# EasyEDA Pro project ProPrj_Hitboard Zero PCB typec 左上开口_2026-02-22.epro

# Board PCB1
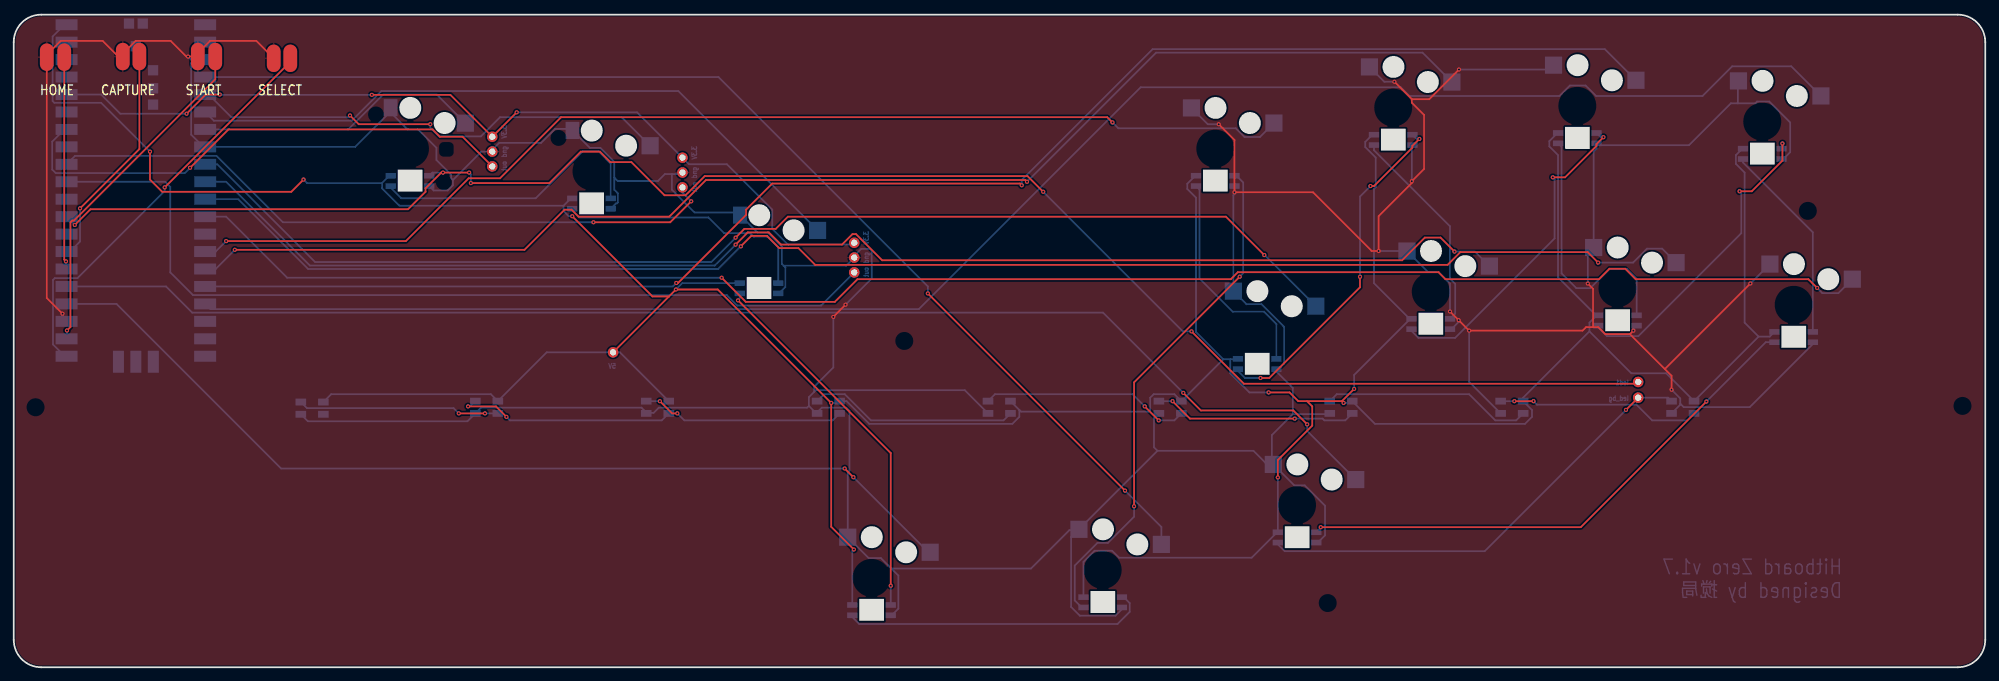
[diagram p0: board, top side]
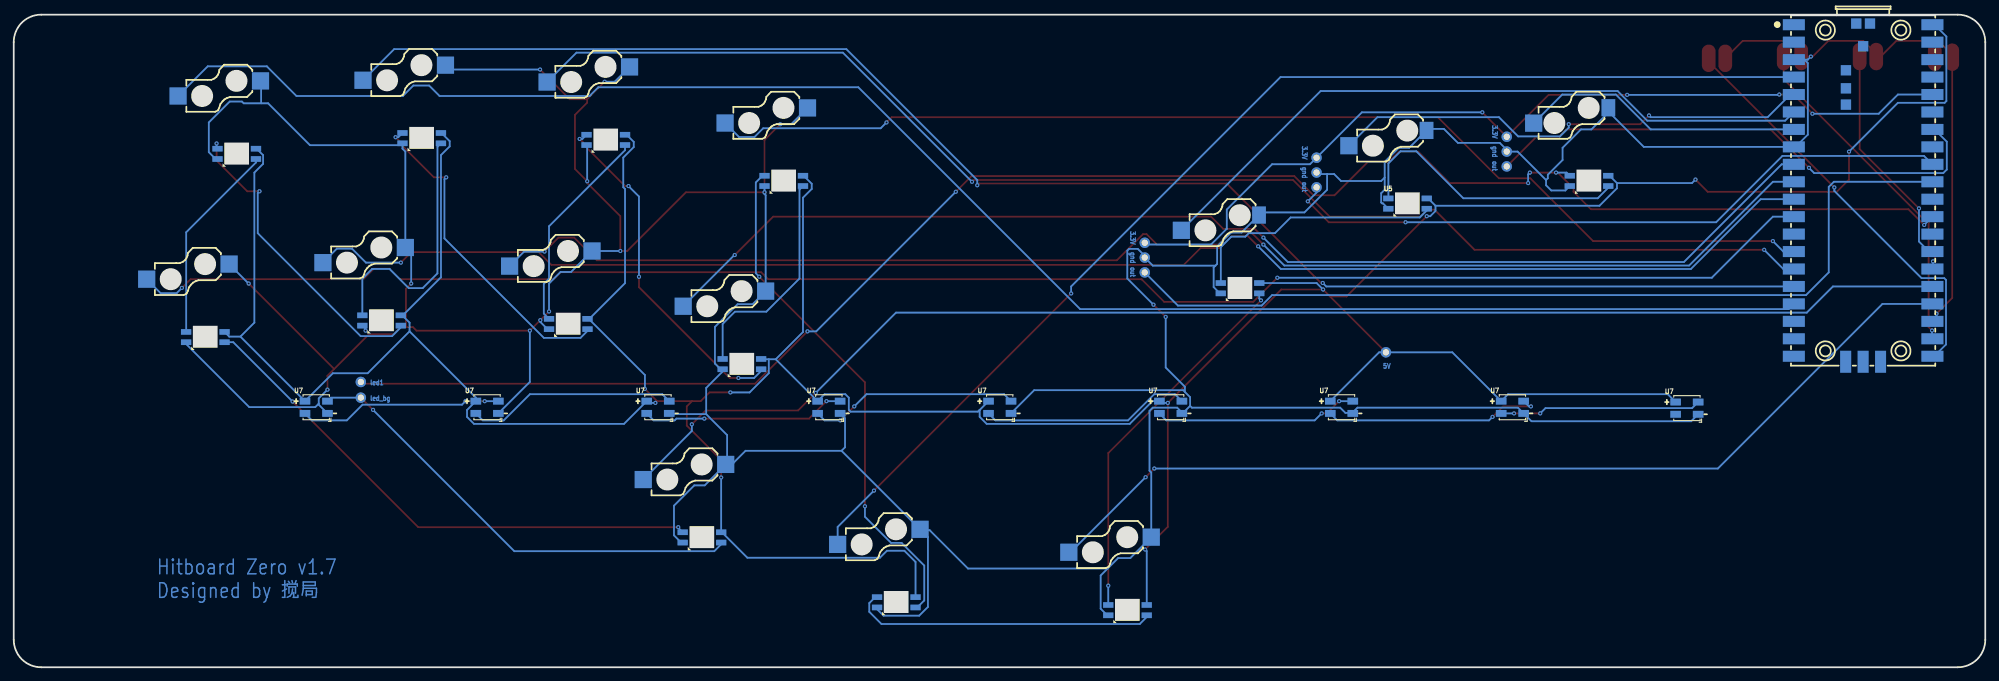
[diagram p1: board, bottom side, seen from below]

Outline 287 x 95 mm; copper layers: Top Layer, Bottom Layer. Coordinates in mm from the lower left corner of the outline.
Outline path: 0,91 arc(1.17,93.83) 4,95 283,95 arc(285.83,93.83) 287,91 287,4 arc(285.83,1.17) 283,0 4,0 arc(1.17,1.17) 0,4 0,91
Stack: Top Layer 0.035mm / Dielectric1 1.51mm FR4 er 4.5 / Bottom Layer 0.035mm

## Design rules (mm)
template: JLCPCB Capability(Two Layers Board)
spacing copperThickness1oz (default): track to track 0.102, other pairs 0.152 to 0.3
spacing copperThickness2oz: track to track 0.203, other pairs 0.152 to 0.3
track width copperThickness1oz (default): min 0.127, default 0.254, max 2.54
track width copperThickness2oz: min 0.203, default 0.254, max 2.54
differential pair differentialPair (default): width min 0.127, default 0.254, max 2.54; gap min 0.152, default 0.152
via viaSize (default): diameter min 0.5, default 0.61, max 10; hole min 0.3, default 0.305, max 6.3

## Placement (name value [footprint] x y rotation side)
NOREF  -  [Pad_e10666]  97.35 69.86 90 top
NOREF#2  -  [Pad_e679]  26.8 88.9 0 top
NOREF#3  -  [Pad_e10656]  122.35 61.8 90 top
NOREF#4  -  [Pad_e682]  40.26 88.65 0 top
NOREF#5  -  [Pad_e10671]  69.66 75.07 90 top
NOREF#6  -  [Pad_e5255]  236.47 39.24 0 top
NOREF#7  -  [Pad_e675]  4.81 88.81 0 top
NOREF#8  -  [Pad_e10670]  69.66 77.23 90 top
NOREF#9  -  [Pad_e681]  37.85 88.65 0 top
NOREF#10  -  [Pad_e10664]  97.35 74.18 90 top
NOREF#11  -  [Pad_e10672]  69.66 72.91 90 top
NOREF#12  -  [Pad_e680]  29.34 88.9 0 top
NOREF#13  -  [Pad_e434]  236.47 41.53 0 top
NOREF#14  -  [Pad_e677]  15.87 88.9 0 top
NOREF#15  -  [Pad_e10658]  122.35 57.48 90 top
NOREF#16  -  [Pad_e10665]  97.35 72.02 90 top
NOREF#17  -  [Pad_e10657]  122.35 59.64 90 top
NOREF#18  -  [Pad_e678]  18.29 88.9 0 top
NOREF#19  -  [Pad_e10654]  87.25 45.85 0 top
NOREF#20  -  [Pad_e676]  7.35 88.81 0 top
U1  PICO  [COMM-SMD_L51.0-W21.0-P2.54_SC0916]  17.78 69.09 270 bottom
U5  -  [LED-SMD_L3.2-W2.8_YO-WS2812B-3528]  186.82 18.9 180 bottom
U5#2  -  [LED-SMD_L3.2-W2.8_YO-WS2812B-3528]  57.69 70.8 180 bottom
U5#3  -  [LED-SMD_L3.2-W2.8_YO-WS2812B-3528]  84.1 67.5 180 bottom
U5#4  -  [LED-SMD_L3.2-W2.8_YO-WS2812B-3528]  108.49 55.18 180 bottom
U5#5  -  [LED-SMD_L3.2-W2.8_YO-WS2812B-3528]  124.87 8.31 180 bottom
U5#6  -  [LED-SMD_L3.2-W2.8_YO-WS2812B-3528]  158.52 9.46 180 bottom
U5#7  -  [LED-SMD_L3.2-W2.8_YO-WS2812B-3528]  174.91 70.8 180 bottom
U5#8  -  [LED-SMD_L3.2-W2.8_YO-WS2812B-3528]  181 44.13 180 bottom
U5#9  -  [LED-SMD_L3.2-W2.8_YO-WS2812B-3528]  200.81 76.77 180 bottom
U5#10  -  [LED-SMD_L3.2-W2.8_YO-WS2812B-3528]  206.28 49.97 180 bottom
U5#11  -  [LED-SMD_L3.2-W2.8_YO-WS2812B-3528]  227.61 77.02 180 bottom
U5#12  -  [LED-SMD_L3.2-W2.8_YO-WS2812B-3528]  233.45 50.48 180 bottom
U5#13  -  [LED-SMD_L3.2-W2.8_YO-WS2812B-3528]  254.54 74.74 180 bottom
U5#14  -  [LED-SMD_L3.2-W2.8_YO-WS2812B-3528]  259.11 48.07 180 bottom
U6  -  [CONN-SMD_HOTPLUGPAKAGE__C9900010116-1]  60.23 80.32 180 bottom
U6#2  -  [CONN-SMD_HOTPLUGPAKAGE__C9900010116-1#2]  86.64 77.02 180 bottom
U6#3  -  [CONN-SMD_HOTPLUGPAKAGE__C9900010116-1#3]  161.06 18.98 180 bottom
U6#4  -  [CONN-SMD_HOTPLUGPAKAGE__C9900010116-1#3]  189.36 28.43 180 bottom
U6#5  -  [CONN-SMD_HOTPLUGPAKAGE__C9900010116-1#3]  127.41 17.84 180 bottom
U6#6  -  [CONN-SMD_HOTPLUGPAKAGE__C9900010116-1#3]  177.45 80.32 180 bottom
U6#7  -  [CONN-SMD_HOTPLUGPAKAGE__C9900010116-1#3]  183.54 53.65 180 bottom
U6#8  -  [CONN-SMD_HOTPLUGPAKAGE__C9900010116-1#3]  203.35 86.29 180 bottom
U6#9  -  [CONN-SMD_HOTPLUGPAKAGE__C9900010116-1#3]  208.82 59.5 180 bottom
U6#10  -  [CONN-SMD_HOTPLUGPAKAGE__C9900010116-1#3]  230.15 86.55 180 bottom
U6#11  -  [CONN-SMD_HOTPLUGPAKAGE__C9900010116-1#3]  235.99 60 180 bottom
U6#12  -  [CONN-SMD_HOTPLUGPAKAGE__C9900010116-1#3]  257.08 84.26 180 bottom
U6#13  -  [CONN-SMD_HOTPLUGPAKAGE__C9900010116-1#3]  261.65 57.59 180 bottom
U6#14  -  [CONN-SMD_HOTPLUGPAKAGE__C9900010116-1#2]  111.03 64.7 180 bottom
U7  -  [LED-SMD_4P-L3.5-W3.5-TL_WS2812B]  43.43 37.72 180 bottom
U7#2  -  [LED-SMD_4P-L3.5-W3.5-TL_WS2812B]  242.97 37.85 180 bottom
U7#3  -  [LED-SMD_4P-L3.5-W3.5-TL_WS2812B]  218.09 37.85 180 bottom
U7#4  -  [LED-SMD_4P-L3.5-W3.5-TL_WS2812B]  193.21 37.85 180 bottom
U7#5  -  [LED-SMD_4P-L3.5-W3.5-TL_WS2812B]  168.34 37.85 180 bottom
U7#6  -  [LED-SMD_4P-L3.5-W3.5-TL_WS2812B]  143.46 37.85 180 bottom
U7#7  -  [LED-SMD_4P-L3.5-W3.5-TL_WS2812B]  118.59 37.85 180 bottom
U7#8  -  [LED-SMD_4P-L3.5-W3.5-TL_WS2812B]  93.71 37.85 180 bottom
U7#9  -  [LED-SMD_4P-L3.5-W3.5-TL_WS2812B]  68.83 37.85 180 bottom

## Footprints (pads in the part's own frame, mm; a bottom-side part is the same pattern mirrored in y, then rotated)
COMM-SMD_L51.0-W21.0-P2.54_SC0916
  rect 1.6x3.2 smd: 1(-24.445,-10.088) 2(-21.905,-10.088) 3(-19.365,-10.088) 4(-16.825,-10.088) 5(-14.285,-10.088) 6(-11.745,-10.088) 7(-9.205,-10.088) 8(-6.665,-10.088) 9(-4.125,-10.088) 10(-1.585,-10.088) 11(0.955,-10.088) 12(3.495,-10.088) 13(6.035,-10.088) 14(8.575,-10.088) 15(11.115,-10.088) 16(13.655,-10.088) 17(16.195,-10.088) 18(18.735,-10.088) 19(21.275,-10.088) 20(23.815,-10.088) 21(23.815,10.088) 22(21.275,10.088) 23(18.735,10.088) 24(16.195,10.088) 25(13.655,10.088) 26(11.115,10.088) 27(8.575,10.088) 28(6.035,10.088) 29(3.495,10.088) 30(0.955,10.088) 31(-1.585,10.088) 32(-4.125,10.088) 33(-6.665,10.088) 34(-9.205,10.088) 35(-11.745,10.088) 36(-14.285,10.088) 37(-16.825,10.088) 38(-19.365,10.088) 39(-21.905,10.088) 40(-24.445,10.088)
  rect 3.2x1.6 smd: 41(24.615,-2.54) 42(24.615,0) 43(24.615,2.54)
  rect 1.5x1.5 smd: TP1(-21.315,0) TP2(-24.615,1) TP3(-24.615,-1) TP4(-17.815,-2.5) TP5(-15.188,-2.5) TP6(-12.815,-2.5)
CONN-SMD_HOTPLUGPAKAGE__C9900010116-1
  rect 2.5x2.5 smd: 1(-5.515,-1.12)
  rect 2x2.5 smd: 2(5.36,1.125)
CONN-SMD_HOTPLUGPAKAGE__C9900010116-1#2
  rect 2.5x2.5 smd: 1(-6,-1.1)
  rect 2x2.5 smd: 2(5.31,1.125)
CONN-SMD_HOTPLUGPAKAGE__C9900010116-1#3
  rect 2.5x2.5 smd: 1(-6,-1.1) 2(6,1.1)
LED-SMD_4P-L3.5-W3.5-TL_WS2812B
  rect 1.545x0.997 smd: 1(-1.637,0.89) 2(-1.637,-0.89) 3(1.637,-0.89) 4(1.637,0.89)
LED-SMD_L3.2-W2.8_YO-WS2812B-3528
  rect 1.5x0.82 smd: 1(2.8,0.75) 2(2.8,-0.75) 3(-2.8,-0.75) 4(-2.8,0.75)
Pad_e434
  round 1.524 hole 0.914: 1(0,0)
Pad_e675
  oval 2x4 smd: 1(0,0)
Pad_e676
  oval 2x4 smd: 1(0,0)
Pad_e677
  oval 2x4 smd: 1(0,0)
Pad_e678
  oval 2x4 smd: 1(0,0)
Pad_e679
  oval 2x4 smd: 1(0,0)
Pad_e680
  oval 2x4 smd: 1(0,0)
Pad_e681
  oval 2x4 smd: 1(0,0)
Pad_e682
  oval 2x4 smd: 1(0,0)
Pad_e5255
  round 1.524 hole 0.914: 1(0,0)
Pad_e10654
  round 1.524 hole 0.914: 1(0,0)
Pad_e10656
  round 1.524 hole 0.914: 1(0,0)
Pad_e10657
  round 1.524 hole 0.914: 1(0,0)
Pad_e10658
  round 1.524 hole 0.914: 1(0,0)
Pad_e10664
  round 1.524 hole 0.914: 1(0,0)
Pad_e10665
  round 1.524 hole 0.914: 1(0,0)
Pad_e10666
  round 1.524 hole 0.914: 1(0,0)
Pad_e10670
  round 1.524 hole 0.914: 1(0,0)
Pad_e10671
  round 1.524 hole 0.914: 1(0,0)
Pad_e10672
  round 1.524 hole 0.914: 1(0,0)

## Nets
3V3: NOREF#3.1 NOREF#8.1 NOREF#10.1 U1.36
GND: NOREF#2.1 NOREF#5.1 NOREF#7.1 NOREF#9.1 NOREF#14.1 NOREF#16.1 NOREF#17.1 U1.3 U1.8 U1.23 U5.3 U5#2.3 U5#3.3 U5#4.3 U5#5.3 U5#6.3 U5#7.3 U5#8.3 U5#9.3 U5#10.3 U5#11.3 U5#12.3 U5#13.3 U5#14.3 U6.2 U6#2.2 U6#3.2 U6#4.2 U6#5.2 U6#6.2 U6#7.2 U6#8.2 U6#9.2 U6#10.2 U6#11.2 U6#12.2 U6#13.2 U6#14.2 U7.3 U7#2.3 U7#3.3 U7#4.3 U7#5.3 U7#6.3 U7#7.3 U7#8.3 U7#9.3
VCC: NOREF#19.1 U1.40 U5.1 U5#2.1 U5#3.1 U5#4.1 U5#5.1 U5#6.1 U5#7.1 U5#8.1 U5#9.1 U5#10.1 U5#11.1 U5#12.1 U5#13.1 U5#14.1 U7.1 U7#2.1 U7#3.1 U7#4.1 U7#5.1 U7#6.1 U7#7.1 U7#8.1 U7#9.1
2: U5#2.2 U5#3.4
3: U5#3.2 U5#4.4
4: U5#4.2 U5#5.4
5: U5#5.2 U5#6.4
6: U5#6.2 U5#7.4
7: U5#7.2 U5#8.4
8: U5#8.2 U5#9.4
9: U5#9.2 U5#10.4
10: U5#10.2 U5#11.4
11: U5#11.2 U5#12.4
12: U5#12.2 U5#13.4
13: U5#13.2 U5#14.4
14: U5.4 U5#14.2
15: NOREF#6.1 U5.2 U7#2.4
16: U7#2.2 U7#3.4
17: U7#3.2 U7#4.4
18: U7#4.2 U7#5.4
19: U7#5.2 U7#6.4
20: U7#6.2 U7#7.4
21: U7#7.2 U7#8.4
22: U7#8.2 U7#9.4
23: U7.4 U7#9.2
24: U7.2
A: U1.9 U6#7.1
B: U1.10 U6#9.1
CAPTURE: NOREF#18.1 U1.27
CIZHOU01: NOREF#11.1 U1.34
CIZHOU02: NOREF.1 U1.32
CIZHOU03: NOREF#15.1 U1.31
DOWN: U1.5 U6#2.1
HOME: NOREF#20.1 U1.26
L3: U1.24 U6#5.1
LB: U1.17 U6#12.1
LED1: NOREF#13.1 U1.29 U5#2.4
LEFT: U1.7 U6.1
LT: U1.12 U6#13.1
R3: U1.25 U6#4.1
RB: U1.16 U6#10.1
RIGHT: U1.6 U6#14.1
RT: U1.11 U6#11.1
SELECT: NOREF#4.1 U1.21
START: NOREF#12.1 U1.22
UP: U1.4 U6#3.1
X: U1.14 U6#6.1
Y: U1.15 U6#8.1

Pads without a net: U1 1 2 13 18 19 20 28 30 33 35 37 38 39 41 42 43 TP1 TP2 TP3 TP4 TP5 TP6

## Via types
v1: diameter 0.61, hole 0.305, Top Layer to Bottom Layer, 93 vias

## Routing (per net, layer and track width the routed paths; a pad name or vN(x,y) marks a point on that pad's centre or on a via; arc(x,y) is an arc through that point)
3V3: length 130.7
  Top Layer w0.254: v1(29.98,83.37) 27.95,83.37 v1(25.16,80.58) ; v1(52.13,83.32) 63.56,83.32 NOREF#8.1 v1(73.22,80.78)
  Bottom Layer w0.254: v1(25.16,80.58) 15.51,80.58 12.71,83.37 U1.36 ; NOREF#3.1 122.1,61.54 112.7,61.54 110.42,63.83 110.42,66.62 103.81,73.23 98.3,73.23 NOREF#10.1 90.74,80.78 v1(73.22,80.78) ; v1(52.13,83.32) 30.04,83.32 v1(29.98,83.37)
GND: length 857.8
  Top Layer w0.254: 15.73,88.9 NOREF#14.1 ; 15.73,88.9 15.22,88.9 12.94,91.19 6.84,91.19 4.81,89.15 NOREF#7.1 4.81,53.76 v1(7.09,51.47) ; 15.73,88.9 15.73,89.15 17.76,91.19 22.84,91.19 25.13,88.9 NOREF#2.1 26.8,89.41 28.57,91.19 35.31,91.19 NOREF#9.1 ; 229.9,49.51 229.9,55.1 v1(229.14,55.86) ; 229.9,49.51 230.67,49.51 231.68,48.49 235.27,48.49 ; 229.9,49.51 228.89,49.51 228.38,49 v1(211.87,49) v1(210.35,50.53) v1(209.08,51.8) ; 235.27,48.49 v1(235.78,49) ; 235.27,48.49 240.35,43.41 ; v1(175.42,79.05) 177.71,76.76 v1(177.71,69.14) 189.14,69.14 197.68,60.6 v1(198.7,60.6) 198.7,65.68 203.52,70.5 v1(203.52,70.76) 205.3,72.53 205.3,80.41 203.52,82.19 203.52,82.69 ; v1(121.08,52.78) v1(119.31,51) ; v1(210.38,87.01) 206.06,82.69 203.52,82.69 ; 240.35,43.41 v1(252.8,55.86) ; 240.35,43.41 241.33,42.44 v1(241.33,40.41) ; 203.52,82.69 v1(200.98,85.23)
  Bottom Layer w0.254: 54.79,80.83 54.79,81.37 U6.2 ; 54.79,80.83 57.33,78.29 58.86,78.29 61.53,75.62 61.53,73.84 63.68,71.69 63.68,71.18 63.94,70.93 ; 54.79,80.83 49.71,75.75 U1.8 27.61,75.75 25.83,77.53 25.83,87.95 26.34,88.45 ; U5#13.3 257.61,73.99 258.61,74.98 258.61,79.3 255.56,82.35 253.78,82.35 253.53,82.1 250.99,82.1 ; U6#10.2 223.52,87.01 v1(210.38,87.01) ; 183.91,43.2 184.93,44.21 184.93,49.55 181.62,52.85 179.45,52.85 U6#7.2 177.54,68.72 177.71,68.89 U5#7.3 ; 183.91,43.2 183.91,42.94 186.2,40.66 186.2,36.85 ; 183.91,43.2 183.91,43.27 U5#8.3 ; 242.6,38.37 242.6,39.14 v1(241.33,40.41) ; 242.6,38.37 242.6,38.23 U7#2.3 ; 242.6,38.37 243.11,37.87 252.71,37.87 261.91,47.06 U5#14.3 ; v1(203.52,70.76) 203.52,75.93 U5#9.3 ; v1(229.14,55.86) 229.14,60.25 U6#11.2 229.99,75.07 230.41,75.49 230.41,76 ; 112.07,58.46 111.82,58.72 111.82,61.26 109.78,63.29 108.26,63.29 U6#14.2 105.34,66.21 99.11,66.21 95.81,69.51 95.81,71.8 ; 112.07,58.46 112.32,58.21 112.32,55.34 111.41,54.43 U5#4.3 ; 112.07,58.46 121.18,58.46 NOREF#17.1 122.35,59.89 123.37,60.91 124.64,60.91 124.89,60.65 124.89,56.59 v1(121.08,52.78) ; 116.51,40.08 115.75,39.32 115.75,38.05 ; 116.51,40.08 116.51,40.84 119.31,43.63 v1(119.31,51) ; 116.51,40.08 116.77,40.33 138.45,40.33 U7#6.3 ; v1(200.98,85.23) 199.51,85.23 U6#8.2 ; 115.75,38.05 116.77,37.03 116.87,37.03 ; 115.75,38.05 115.5,37.79 93.91,37.79 93.14,37.03 92.15,37.03 ; 127.76,14.37 148.08,14.37 153.67,19.96 154.94,19.96 ; 127.76,14.37 126.23,15.89 124.46,15.89 U6#5.2 121.41,28.36 121.66,28.61 121.66,37.32 121.19,37.79 117.64,37.79 116.87,37.03 ; 127.76,14.37 128.77,13.35 128.77,8.53 127.81,7.56 U5#5.3 ; 154.94,19.96 U6#3.2 166.49,31.51 ; 154.94,19.96 153.92,18.94 153.92,8.78 155.19,7.51 160.38,7.51 161.32,8.45 U5#6.3 ; v1(7.09,51.47) 7.09,50.95 U1.23 ; 116.87,37.03 U7#7.3 ; 63.94,70.93 63.94,70.17 63.17,69.4 61.13,69.4 U5#2.3 ; 63.94,70.93 68.08,75.07 NOREF#5.1 69.66,75.32 70.68,76.34 76.77,76.34 78.8,78.37 81.11,78.37 U6#2.2 83.87,75.61 85.4,75.61 87.43,73.58 87.43,71.29 ; 92.15,37.03 U7#8.3 ; 92.15,37.03 91.39,37.79 68.03,37.79 U7#9.3 66.05,35.81 42.81,35.81 U7.3 ; 250.99,82.1 250.99,85.27 251.08,85.36 ; 250.99,82.1 249.97,82.1 243.87,76 230.41,76 ; U7#5.3 165.99,36.24 165.99,32.02 166.49,31.51 ; 87.43,71.29 87.43,69.51 87.94,69 87.94,67.65 87.81,67.53 87.68,67.53 U5#3.3 ; 87.43,71.29 87.94,70.78 93.78,70.78 94.79,71.8 95.81,71.8 ; U5#12.3 235.78,49.26 v1(235.78,49) ; 166.49,31.51 180.46,31.51 182.24,29.74 183.15,29.74 ; 186.2,36.85 183.15,33.8 183.15,29.74 ; 186.2,36.85 191.47,36.85 U7#4.3 ; v1(198.7,60.6) U6#9.2 205.86,57.55 207.39,57.55 209.08,55.86 v1(209.08,51.8) ; 230.41,76 U5#11.3 ; 26.34,88.45 25.83,88.45 v1(25.38,88.9) ; 26.34,88.45 U1.3 ; v1(211.87,49) 211.87,41.54 U7#3.3 ; U5.3 189.84,18.15 190.89,19.2 190.89,23.52 187.93,26.48 186.41,26.48 183.15,29.74 ; U6#6.2 173.82,79.05 v1(175.42,79.05) ; v1(210.35,50.53) 210.35,50.27 209.45,49.37 209.23,49.37 U5#10.3 ; 95.81,71.8 97.12,71.8 NOREF#16.1 ; v1(252.8,55.86) 252.82,55.86 255.65,58.69
VCC: length 628.7
  Top Layer w0.254: 95.38,53.98 92.99,53.98 v1(81.3,65.66) ; 95.38,53.98 v1(96.39,54.99) 102.49,54.99 v1(119,38.48) 119,20.45 v1(122.3,17.15) ; 95.38,53.98 NOREF#19.1 ; v1(182.68,40.01) 185.72,40.01 186.99,38.74 188.26,38.74 ; 193.34,38.74 v1(193.6,38.48) ; 193.34,38.74 188.26,38.74 ; 193.34,38.74 v1(195.12,40.51) ; 188.26,38.74 189.03,37.97 189.03,35.18 184.02,30.17 v1(184.02,27.63) ; v1(42.19,70.99) 40.41,69.22 21.61,69.22 19.83,70.99 v1(19.83,75.06)
  Bottom Layer w0.254: 254,48.13 251.97,50.17 251.97,72.01 250.7,73.28 250.7,74.55 251.64,75.49 U5#13.1 ; 254,48.13 255.63,48.13 U5#14.1 ; 254,48.13 U7#2.1 240.54,42.8 235.48,42.8 229.38,48.9 ; v1(122.3,17.15) 122.07,16.91 U5#5.1 ; U5#4.1 97.33,55.93 v1(96.39,54.99) ; 229.38,48.9 229.38,50.17 230.4,51.18 ; 229.38,48.9 219.73,39.24 U7#3.1 221.01,37.45 221.01,36.45 220,35.43 198.15,35.43 U7#4.1 194.6,38.48 v1(193.6,38.48) ; 53.62,70.49 42.69,70.49 v1(42.19,70.99) ; 53.62,70.49 54.68,71.55 U5#2.1 ; 53.62,70.49 53.62,69.72 56.16,67.18 80.03,67.18 ; 80.03,67.18 80.03,66.42 80.79,65.66 v1(81.3,65.66) ; 80.03,67.18 81.1,68.25 U5#3.1 ; U5#7.1 172,71.55 170.84,70.39 170.84,69.63 172.11,68.36 172.11,48.8 176.07,44.83 ; 203.25,50.67 195.12,42.55 v1(195.12,40.51) ; 203.25,50.67 198.01,55.91 198.01,69.63 198.27,69.88 198.27,74.2 196.74,75.72 196.74,76.48 197.78,77.52 U5#9.1 ; 203.25,50.67 U5#10.1 ; U5#8.1 178.16,44.83 177.09,44.83 ; v1(19.83,75.06) 12.72,82.17 5.91,82.17 5.66,82.42 5.66,91.82 7.37,93.53 U1.40 ; 230.4,51.18 U5#12.1 ; 230.4,51.18 224.81,56.77 224.81,74.55 223.54,75.82 223.54,76.58 224.73,77.77 U5#11.1 ; U5#6.1 155.72,15.34 157.35,16.96 159.89,16.96 160.9,15.95 180.21,15.95 184.02,19.76 ; U7.1 46.21,39.75 69.46,39.75 U7#9.1 77.58,45.85 NOREF#19.1 88.24,45.85 U7#8.1 ; 177.09,44.83 177.09,42.8 179.88,40.01 v1(182.68,40.01) ; 177.09,44.83 176.07,44.83 ; v1(184.02,27.63) 184.02,19.76 ; 184.02,19.76 184.02,19.65 ; 146.39,37.47 146.64,37.21 165.18,37.21 165.44,37.47 165.44,39.24 165.94,39.75 168.96,39.75 U7#5.1 176.07,44.83 ; U7#6.1 146.37,37.47 146.39,37.46 146.39,36.45 145.37,35.43 124.54,35.43 121.24,38.74 U7#7.1 119.97,38.48 v1(119,38.48)
2: length 41.6
  Bottom Layer w0.254: U5#2.2 54.89,69.8 56.41,68.27 75.98,68.27 82.83,75.12 85.11,75.12 86.89,73.34 86.89,68.26 U5#3.4
3: length 37.7
  Bottom Layer w0.254: U5#4.4 111.29,61.15 109.75,62.68 107.72,62.68 107.21,63.19 103.4,63.19 101.11,65.48 82.32,65.48 81.3,66.49 U5#3.2
4: length 54.7
  Top Layer w0.254: v1(127.67,11.87) 127.67,31.18 v1(105.43,53.41)
  Bottom Layer w0.254: U5#4.2 105.69,53.67 v1(105.43,53.41) ; v1(127.67,11.87) U5#5.4
5: length 44.6
  Bottom Layer w0.254: U5#6.4 161.43,10.11 161.69,10.11 162.45,9.34 162.45,8.07 160.68,6.3 123.08,6.3 122.07,7.31 U5#5.2
6: length 75.3
  Top Layer w0.254: v1(163.09,23.44) 163.09,41.47 v1(178.47,56.85)
  Bottom Layer w0.254: U5#6.2 155.47,8.71 154.45,9.72 154.45,14.8 157.76,18.11 159.28,18.11 163.09,21.92 v1(163.09,23.44) ; U5#7.4 178,71.55 178.98,70.57 178.98,57.36 v1(178.47,56.85)
7: length 32.7
  Bottom Layer w0.254: U5#8.4 183.8,49.97 182.01,51.76 177.44,51.76 172.61,56.59 172.61,69.54 U5#7.2
8: length 50.6
  Top Layer w0.254: v1(195.98,56.84) 195.98,55.32 182.77,42.11 v1(181.5,42.11) ; v1(204.62,76.91) 203.6,75.89 203.6,75.64 198.01,70.05 v1(197.51,70.05)
  Bottom Layer w0.254: v1(195.98,56.84) 195.98,68.53 v1(197.51,70.05) ; U5#8.2 178.2,43.13 179.22,42.11 v1(181.5,42.11) ; v1(204.62,76.91) 204.23,76.91 U5#9.4
9: length 30.5
  Bottom Layer w0.254: U5#9.2 198.01,75.26 209.08,64.2 209.08,56.58 209.84,55.81 209.84,51.48 U5#10.4
10: length 47.7
  Top Layer w0.254: v1(224.05,71.32) 225.83,71.32 230.4,75.89 230.4,76.15 v1(231.42,77.16)
  Bottom Layer w0.254: U5#11.4 231.02,77.16 v1(231.42,77.16) ; v1(224.05,71.32) 224.3,71.07 224.3,62.43 209.83,47.95 204.49,47.95 203.48,48.97 U5#10.2
11: length 38
  Bottom Layer w0.254: U5#12.4 236.25,56.56 234.83,57.98 232.29,57.98 229.5,55.19 227.47,55.19 225.32,57.34 225.32,75.76 U5#11.2
12: length 45.4
  Top Layer w0.254: v1(257.47,76.25) 257.47,73.76 253.01,69.29 v1(251.23,69.29)
  Bottom Layer w0.254: v1(257.47,76.25) 257.47,75.63 U5#13.4 ; U5#12.2 230.65,49.48 231.92,48.21 236.5,48.21 251.48,63.19 251.48,69.03 v1(251.23,69.29)
13: length 29.4
  Bottom Layer w0.254: U5#13.2 251.74,73.48 261.9,63.32 261.9,48.83 U5#14.4
14: length 78.2
  Top Layer w0.254: v1(246.4,38.68) 228.11,20.39 v1(190.27,20.39)
  Bottom Layer w0.254: U5#14.2 255.04,47.32 v1(246.4,38.68) ; v1(190.27,20.39) 190.27,20.3 U5.4
15: length 67.5
  Top Layer w0.254: NOREF#6.1 v1(234.7,37.47)
  Bottom Layer w0.254: v1(234.7,37.47) 214.12,16.89 185.02,16.89 184.02,17.9 184.02,18.15 ; NOREF#6.1 240.82,39.24 U7#2.4
16: length 29.7
  Top Layer w0.254: v1(221.24,38.73) v1(218.44,38.73)
  Bottom Layer w0.254: U7#2.2 243.59,35.94 238.51,35.94 236.22,38.23 221.74,38.23 v1(221.24,38.73) ; v1(218.44,38.73) 216.45,38.73
17: length 30.6
  Bottom Layer w0.254: U7#4.4 192.59,39.75 211.85,39.75 215.66,35.94 218.71,35.94 U7#3.2
18: length 29.7
  Top Layer w0.254: v1(168.69,38.73) 171.23,36.19 v1(186.47,36.19)
  Bottom Layer w0.254: v1(168.69,38.73) 166.7,38.73 ; v1(186.47,36.19) 190.53,36.19 190.79,35.94 193.84,35.94 U7#4.2
19: length 30.6
  Top Layer w0.254: v1(166.67,35.94) v1(164.64,37.97)
  Bottom Layer w0.254: v1(164.64,37.97) 162.86,39.75 142.84,39.75 U7#6.4 ; v1(166.67,35.94) 168.96,35.94 U7#5.2
20: length 30.6
  Bottom Layer w0.254: U7#6.2 144.08,35.94 124.78,35.94 120.97,39.75 117.96,39.75 U7#7.4
21: length 29.7
  Top Layer w0.254: v1(96.6,36.96) 95.84,36.96 v1(94.06,38.73)
  Bottom Layer w0.254: v1(96.6,36.96) 97.62,35.94 119.21,35.94 U7#7.2 ; v1(94.06,38.73) 92.07,38.73
22: length 31.8
  Top Layer w0.254: v1(66.14,37.97) 70.2,37.97 v1(71.73,36.45)
  Bottom Layer w0.254: U7#9.4 66.43,37.97 v1(66.14,37.97) ; U7#8.2 94.33,35.94 72.23,35.94 v1(71.73,36.45)
23: length 29.4
  Top Layer w0.254: v1(64.79,36.96) v1(68.6,36.96)
  Bottom Layer w0.254: U7.4 42.69,37.72 64.02,37.72 v1(64.79,36.96) ; v1(68.6,36.96) U7#9.2
A: length 175.7
  Top Layer w0.254: v1(182.05,60.01) 176.46,65.59 112.7,65.59 110.93,63.82 106.35,63.82 v1(105.08,62.55)
  Bottom Layer w0.254: v1(182.05,60.01) 182.09,60.01 U6#7.1 ; v1(105.08,62.55) 101.53,58.99 43.87,58.99 29.65,73.21 U1.9
B: length 200
  Top Layer w0.254: v1(209.73,60.51) 207.7,62.55 205.41,62.55 202.11,59.24 126.42,59.24 122.61,63.05 122.1,63.05 120.58,61.53 111.69,61.53 109.91,63.31 106.86,63.31 v1(105.08,61.53)
  Bottom Layer w0.254: v1(105.08,61.53) 102.04,58.48 43.11,58.48 30.92,70.67 U1.10 ; v1(209.73,60.51) 212.7,60.51 U6#9.1
CAPTURE: length 33.1
  Top Layer w0.254: NOREF#18.1 18.29,75.44 v1(9.65,66.8)
  Bottom Layer w0.254: v1(9.65,66.8) 9.65,61.98 8.38,60.71 7.89,60.71 U1.27
CIZHOU01: length 76
  Top Layer w0.254: v1(25.67,72.71) 31.25,78.29 60.97,78.29 62.04,77.23 65.34,77.23 NOREF#11.1
  Bottom Layer w0.254: v1(25.67,72.71) 24.9,71.94 6.11,71.94 5.6,72.45 5.6,76.52 7.38,78.29 U1.34
CIZHOU02: length 99.2
  Top Layer w0.254: v1(84.39,64.78) 95.57,64.78 v1(98.62,67.83)
  Bottom Layer w0.254: v1(84.39,64.78) 39.18,64.78 29.53,74.43 8.91,74.43 U1.32 ; NOREF.1 97.35,69.1 v1(98.62,67.83)
CIZHOU03: length 131.4
  Bottom Layer w0.254: U1.31 22.04,70.67 22.79,69.92 22.79,57.48 26.09,54.18 103.81,54.18 105.34,52.65 117.53,52.65 NOREF#15.1
DOWN: length 70.7
  Top Layer w0.254: v1(48.95,80.33) 50.22,79.06 v1(60.63,79.06)
  Bottom Layer w0.254: U6#2.1 88.49,80.07 70.79,80.07 68,77.28 61.9,77.28 60.63,78.55 v1(60.63,79.06) ; v1(48.95,80.33) 48.7,80.07 31.68,80.07 28.38,83.37 U1.5
HOME: length 31
  Top Layer w0.254: v1(7.6,59.09) 7.35,59.34 NOREF#20.1
  Bottom Layer w0.254: U1.26 7.6,58.06 v1(7.6,59.09)
L3: length 140.7
  Top Layer w0.254: v1(122.23,27.66) v1(120.96,28.93)
  Bottom Layer w0.254: U6#5.1 133.15,16.74 v1(122.23,27.66) ; U1.24 14.96,52.89 38.92,28.93 v1(120.96,28.93)
LB: length 254.3
  Bottom Layer w0.254: U1.17 28.63,52.13 131.75,52.13 164.05,84.43 201.9,84.43 203.17,83.16 225.01,83.16 226.54,84.69 228.82,84.69 230.35,83.16 245.84,83.16 250.16,87.48 258.76,87.48 U6#12.1
LED1: length 254.6
  Top Layer w0.254: v1(66.55,70.49) 77.98,70.49 82.55,75.06 85.34,75.06 86.87,73.53 89.92,73.53 94.74,68.71 97.79,68.71 100.58,71.5 147.57,71.5 v1(149.86,69.22) ; v1(171.45,48.9) 179.07,41.28 236.22,41.28 NOREF#13.1 ; v1(66.29,72.01) v1(62.48,72.01) 62.23,72.01 59.94,69.72 59.94,69.22 57.4,66.68 11.18,66.68 v1(8.89,64.39)
  Bottom Layer w0.254: v1(8.89,64.39) U1.29 ; v1(66.29,72.01) 66.55,71.76 v1(66.55,70.49) ; v1(171.45,48.9) 170.18,48.9 v1(149.86,69.22) ; v1(62.48,72.01) 60.95,72.01 U5#2.4
LEFT: length 41.7
  Bottom Layer w0.254: U6.1 61.57,83.37 53.78,83.37 48.7,78.29 U1.7
LT: length 250.1
  Top Layer w0.254: v1(262.52,55.22) 261.25,56.49 236.11,56.49 234.58,58.02 232.3,58.02 230.77,56.49 208.42,56.49 207.4,57.51 178.19,57.51 177.18,56.49 122.82,56.49 119.52,53.19 106.57,53.19 v1(103.05,56.7)
  Bottom Layer w0.254: U6#13.1 265.62,54.46 263.28,54.46 v1(262.52,55.22) ; U1.12 30.92,65.59 39.81,56.7 v1(103.05,56.7)
R3: length 199.9
  Top Layer w0.254: v1(170.25,39.94) 172.81,37.38 186.27,37.38 v1(188.29,35.37)
  Bottom Layer w0.254: v1(170.25,39.94) 158.57,51.62 25.98,51.62 22.17,55.43 U1.25 ; v1(188.29,35.37) 188.29,34.4 U6#4.1
RB: length 225.6
  Top Layer w0.254: v1(146.74,70.17) 146.49,70.42 110.42,70.42 106.61,66.61 106.61,65.85 96.7,55.94 v1(96.45,55.94)
  Bottom Layer w0.254: U6#10.1 231.62,89.98 165.79,89.98 146.74,70.93 v1(146.74,70.17) ; U1.16 95.94,55.43 v1(96.45,55.94)
RIGHT: length 99.9
  Bottom Layer w0.254: U1.6 29.14,79.56 49.2,79.56 53.52,83.88 96.75,83.88 U6#14.1
RT: length 225.2
  Top Layer w0.254: v1(230.64,58.9) 229.12,60.43 210.58,60.43 208.72,58.57 116.67,58.57 114.23,61.02 111.43,61.02 109.66,62.8 107.37,62.8 v1(105.85,61.28)
  Bottom Layer w0.254: v1(105.85,61.28) 102.54,57.97 42.85,57.97 32.69,68.13 U1.11 ; U6#11.1 239.96,60.94 237.76,60.94 235.72,58.9 v1(230.64,58.9)
SELECT: length 60.6
  Top Layer w0.254: v1(21.97,69.85) 40.26,88.14 NOREF#4.1
  Bottom Layer w0.254: U1.21 7.5,45.47 7.24,45.47 5.71,46.99 5.71,56.39 5.97,56.64 9.27,56.64 21.97,69.34 v1(21.97,69.85)
START: length 50.2
  Top Layer w0.254: v1(7.75,49.02) 8.26,49.53 8.26,64.77 8.51,65.02 8.76,65.02 29.34,85.6 NOREF#12.1
  Bottom Layer w0.254: U1.22 7.75,47.87 v1(7.75,49.02)
UP: length 169.5
  Top Layer w0.254: v1(133.07,54.42) v1(161.77,25.72)
  Bottom Layer w0.254: U1.4 102.59,85.91 133.07,55.43 v1(133.07,54.42) ; v1(161.77,25.72) 167.06,20.42 U6#3.1
X: length 165.7
  Top Layer w0.254: v1(159.95,79.31) 159.19,80.07 79.68,80.07 70.79,71.18 66.22,71.18 57.08,62.04 v1(30.92,62.04)
  Bottom Layer w0.254: U6#6.1 181.41,77.19 179.17,77.19 177.9,78.46 160.79,78.46 v1(159.95,79.31) ; U1.14 29.39,60.51 v1(30.92,62.04)
Y: length 197.4
  Top Layer w0.254: v1(147.5,70.67) 147.25,70.93 100.77,70.93 95.43,65.59 82.22,65.59 81.21,66.61 80.19,66.61 74.35,60.77 v1(32.19,60.77)
  Bottom Layer w0.254: v1(147.5,70.67) 166.3,89.47 205.08,89.47 U6#8.1 ; U1.15 29.39,57.97 v1(32.19,60.77)

## Copper pours and planes (outline as drawn; the poured copper is in the pictures)
GND on Top Layer: -5.08,100.58 312.17,100.58 312.17,-5.84 -5.08,-5.84

## Text on the board
Bottom Layer: 5V | led1 | led_bg | out | 3.3V | gnd | Hitboard Zero v1.7 / Designed by 搅局
Top Silkscreen Layer: HOME | CAPTURE | START | SELECT
